# EAGLE design BMS Master V2.0 (EAGLE 6.5.0)
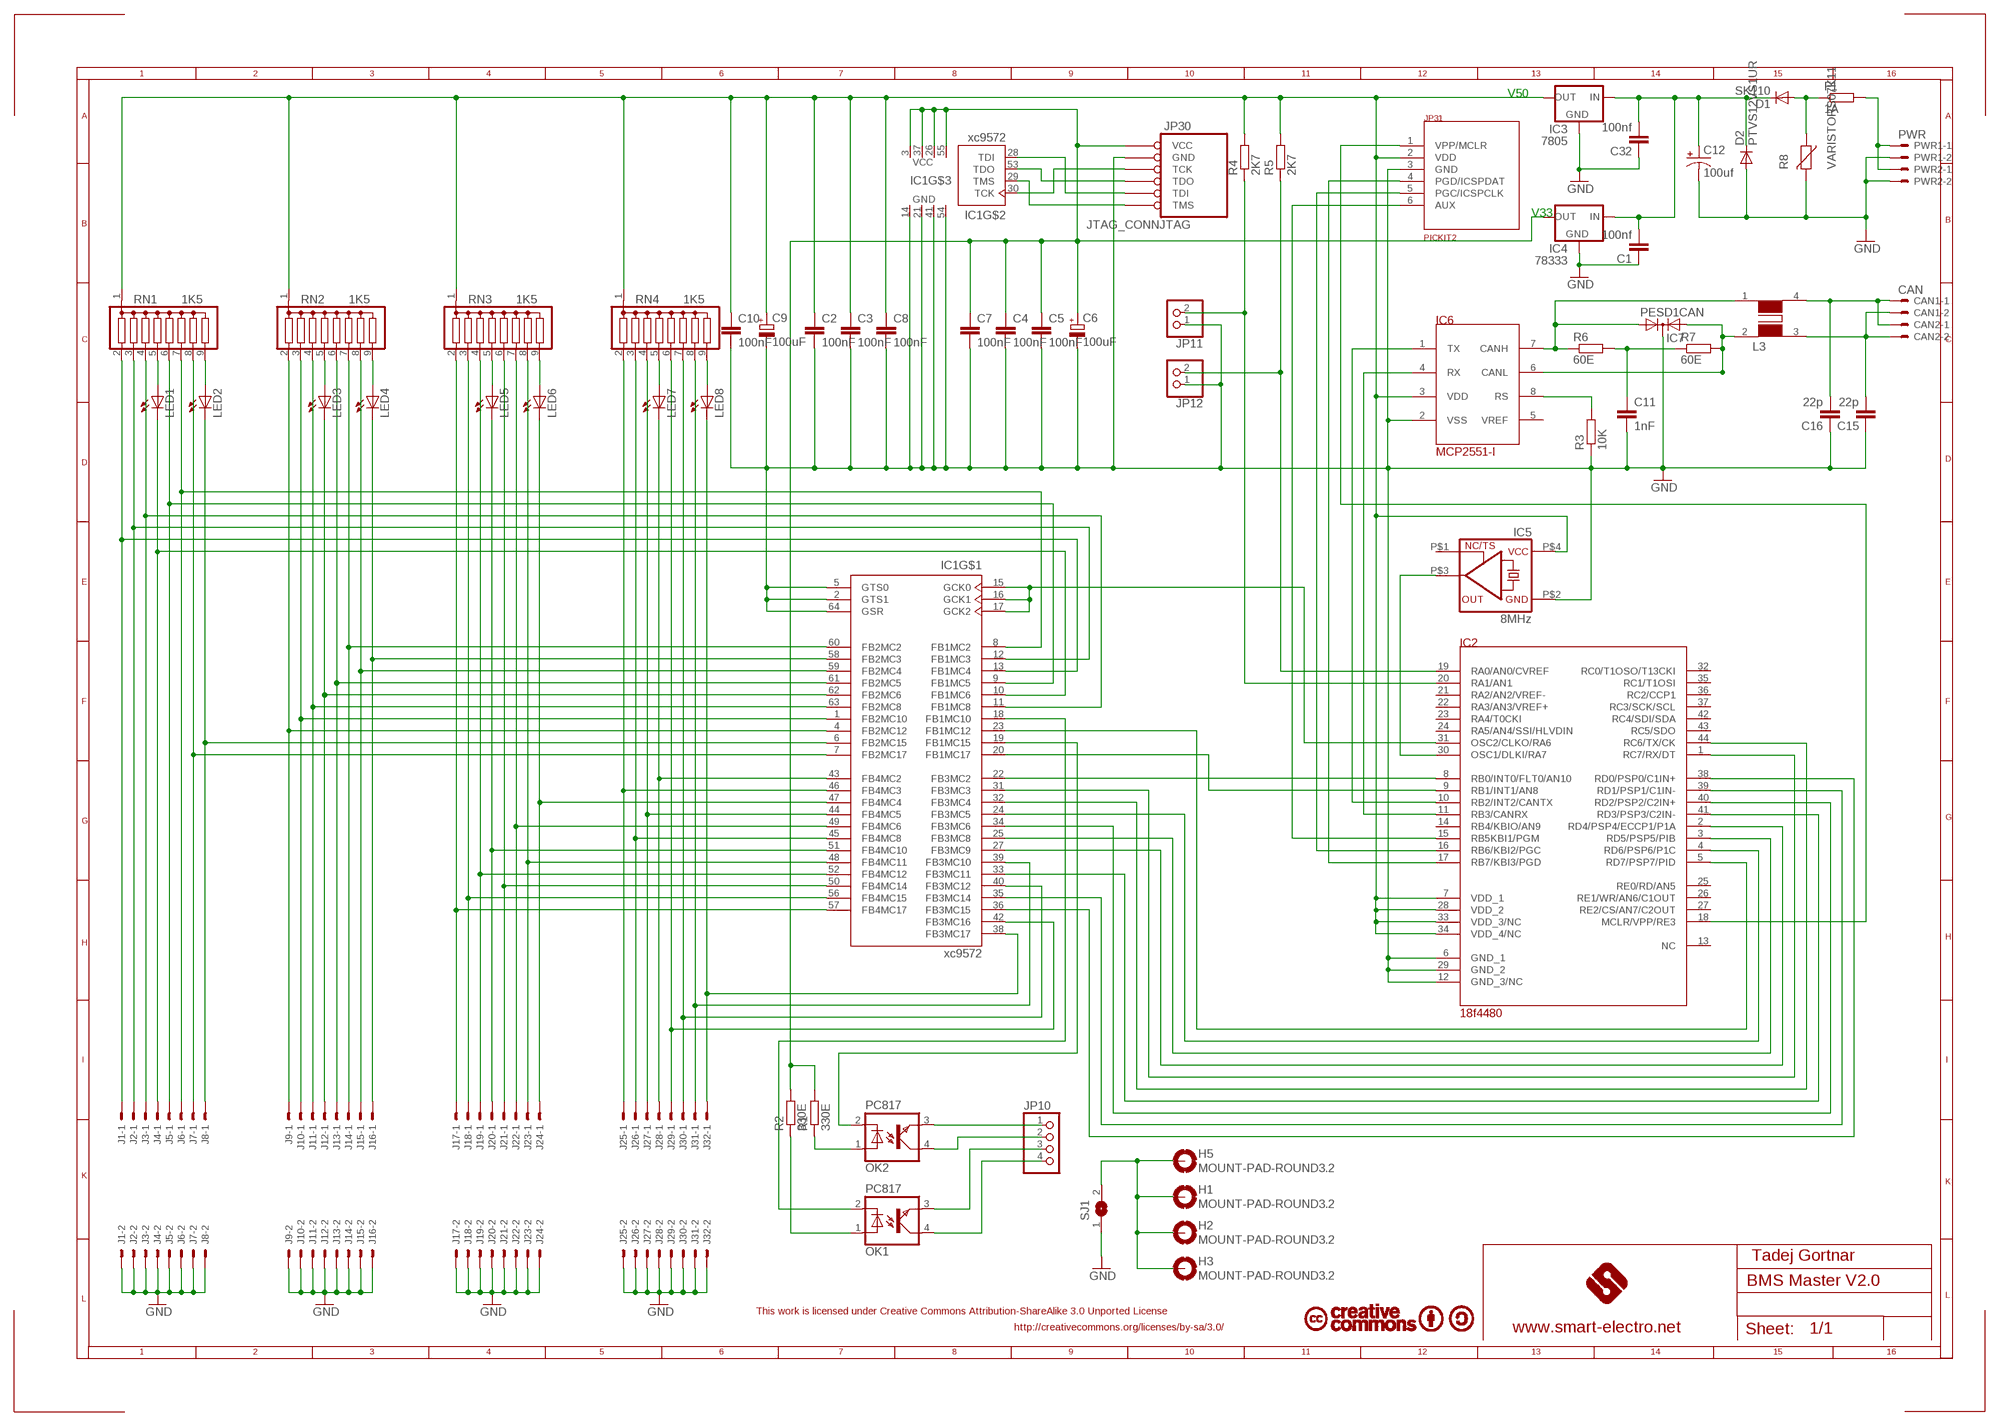
[diagram p0: schematic, sheet 1]

## Parts
C1  100nf  C-EUC0805  [C0805]
C2  100nF  C-EUC0805  [C0805]
C3  100nF  C-EUC0805  [C0805]
C4  100nF  C-EUC0805  [C0805]
C5  100nF  C-EUC0805  [C0805]
C6  100uF  CPOL-EUE2.5-5  [E2,5-5]
C7  100nF  C-EUC0805  [C0805]
C8  100nF  C-EUC0805  [C0805]
C9  100uF  CPOL-EUE2.5-5  [E2,5-5]
C10  100nF  C-EUC0805  [C0805]
C11  1nF  C-EUC0805  [C0805]
C12  100uf  CPOL-USC  [PANASONIC_C]
C15  22p  C-EUC0805  [C0805]
C16  22p  C-EUC0805  [C0805]
C32  100nf  C-EUC0805  [C0805]
CAN1  CAN  22-27-2021-02  [6410-02]
CAN2  CAN  22-27-2021-02  [6410-02]
D1  SK110  DIODE-MINIMELF  [MINIMELF]
D2  PTVS12VS1UR  DIODE-SOD323-W  [SOD323-W]
F1  1A  R-EU_R1206  [R1206]
H1  MOUNT-PAD-ROUND3.2  [3,2-PAD]
H2  MOUNT-PAD-ROUND3.2  [3,2-PAD]
H3  MOUNT-PAD-ROUND3.2  [3,2-PAD]
H5  MOUNT-PAD-ROUND3.2  [3,2-PAD]
IC1  xc9572  XC9572-VQ64  [VQ64]
IC2  18f4480  PIC18F4480  [TQFP44]
IC3  7805  78XXS'SOT223'  [SOT223]
IC4  78333  78XXS'SOT223'  [SOT223]
IC5  8MHz  OSCI7X5  [CSX750]
IC6  MCP2551-I  MCP2551  [SO-08]
IC7  PESD1CAN  BAS70-06  [SOT23]
J1  22-27-2021-02  [6410-02]
J2  22-27-2021-02  [6410-02]
J3  22-27-2021-02  [6410-02]
J4  22-27-2021-02  [6410-02]
J5  22-27-2021-02  [6410-02]
J6  22-27-2021-02  [6410-02]
J7  22-27-2021-02  [6410-02]
J8  22-27-2021-02  [6410-02]
J9  22-27-2021-02  [6410-02]
J10  22-27-2021-02  [6410-02]
J11  22-27-2021-02  [6410-02]
J12  22-27-2021-02  [6410-02]
J13  22-27-2021-02  [6410-02]
J14  22-27-2021-02  [6410-02]
J15  22-27-2021-02  [6410-02]
J16  22-27-2021-02  [6410-02]
J17  22-27-2021-02  [6410-02]
J18  22-27-2021-02  [6410-02]
J19  22-27-2021-02  [6410-02]
J20  22-27-2021-02  [6410-02]
J21  22-27-2021-02  [6410-02]
J22  22-27-2021-02  [6410-02]
J23  22-27-2021-02  [6410-02]
J24  22-27-2021-02  [6410-02]
J25  22-27-2021-02  [6410-02]
J26  22-27-2021-02  [6410-02]
J27  22-27-2021-02  [6410-02]
J28  22-27-2021-02  [6410-02]
J29  22-27-2021-02  [6410-02]
J30  22-27-2021-02  [6410-02]
J31  22-27-2021-02  [6410-02]
J32  22-27-2021-02  [6410-02]
JP10  PINHD-1X4  [1X04]
JP11  PINHD-1X2  [1X02]
JP12  PINHD-1X2  [1X02]
JP30  JTAG_CONNJTAG  [PIN06]
JP31  PICKIT2  [PINHD-1X6]
L3  WE-DD_M/S  [WE-DD_M/S]
LED1  LEDCHIPLED_0805  [CHIPLED_0805]
LED2  LEDCHIPLED_0805  [CHIPLED_0805]
LED3  LEDCHIPLED_0805  [CHIPLED_0805]
LED4  LEDCHIPLED_0805  [CHIPLED_0805]
LED5  LEDCHIPLED_0805  [CHIPLED_0805]
LED6  LEDCHIPLED_0805  [CHIPLED_0805]
LED7  LEDCHIPLED_0805  [CHIPLED_0805]
LED8  LEDCHIPLED_0805  [CHIPLED_0805]
OK1  PC817  [DIL04]
OK2  PC817  [DIL04]
PWR1  PWR  22-27-2021-02  [6410-02]
PWR2  PWR  22-27-2021-02  [6410-02]
R1  330E  R-EU_M0805  [M0805]
R2  330E  R-EU_M0805  [M0805]
R3  10K  R-EU_M0805  [M0805]
R4  2K7  R-EU_M0805  [M0805]
R5  2K7  R-EU_M0805  [M0805]
R6  60E  R-EU_R0805  [R0805]
R7  60E  R-EU_R0805  [R0805]
R8  VARISTORS07K11  [S07K11]
RN1  1K5  G08R  [SIL9]
RN2  1K5  G08R  [SIL9]
RN3  1K5  G08R  [SIL9]
RN4  1K5  G08R  [SIL9]
SJ1  SJ  [SJ]

## Nets
AGND: H1.B3,2(MOUNT) H2.B3,2(MOUNT) H3.B3,2(MOUNT) H5.B3,2(MOUNT) SJ1.2
GND: C1.1 C2.2 C3.2 C4.2 C5.2 C6.- C7.2 C8.2 C9.- C10.2 C11.2 C12.- C15.1 C16.1 C32.1 D2.A IC1.2(GTS1) IC1.5(GTS0) IC1.14(GND) IC1.21(GND) IC1.41(GND) IC1.54(GND) IC1.64(GSR) IC2.6(GND_1) IC2.12(GND_3/NC) IC2.29(GND_2) IC3.2(GND) IC4.2(GND) IC5.P$2(GND) IC6.2(VSS) IC7.3(C) J1.2 J2.2 J3.2 J4.2 J5.2 J6.2 J7.2 J8.2 J9.2 J10.2 J11.2 J12.2 J13.2 J14.2 J15.2 J16.2 J17.2 J18.2 J19.2 J20.2 J21.2 J22.2 J23.2 J24.2 J25.2 J26.2 J27.2 J28.2 J29.2 J30.2 J31.2 J32.2 JP11.1 JP12.1 JP30.2(GND) JP31.3(GND) PWR1.2 PWR2.2 R3.1 R8.2 SJ1.1
N$1: IC1.23(FB1MC12) IC2.5(RD7/PSP7/PID)
N$2: IC1.9(FB1MC5) J5.1 RN1.6
N$3: IC1.8(FB1MC2) J6.1 RN1.7
N$4: IC1.44(FB4MC5) J27.1 RN4.4
N$5: IC1.45(FB4MC8) J26.1 RN4.3
N$6: IC1.46(FB4MC3) J25.1 RN4.2
N$7: IC1.7(FB2MC17) J7.1 RN1.8
N$8: IC1.61(FB2MC5) J13.1 RN2.6
N$9: IC1.60(FB2MC2) J14.1 RN2.7
N$10: IC1.52(FB4MC12) J19.1 RN3.4
N$11: IC1.56(FB4MC15) J18.1 RN3.3
N$12: IC2.18(MCLR/VPP/RE3) JP31.1(VPP/MCLR)
N$13: IC1.59(FB2MC4) J15.1 RN2.8
N$14: IC1.50(FB4MC14) J21.1 RN3.6
N$15: IC1.49(FB4MC6) J22.1 RN3.7
N$16: IC1.63(FB2MC8) J11.1 RN2.4
N$17: IC1.1(FB2MC10) J10.1 RN2.3
N$18: IC1.4(FB2MC12) J9.1 RN2.2
N$19: IC1.48(FB4MC11) J23.1 RN3.8
N$20: IC1.42(FB3MC16) J29.1 RN4.6
N$21: IC1.40(FB3MC12) J30.1 RN4.7
N$22: IC1.11(FB1MC8) J3.1 RN1.4
N$23: IC1.12(FB1MC3) J2.1 RN1.3
N$24: IC1.13(FB1MC4) J1.1 RN1.2
N$25: IC2.17(RB7/KBI3/PGD) JP31.4(PGD/ICSPDAT)
N$26: IC2.16(RB6/KBI2/PGC) JP31.5(PGC/ICSPCLK)
N$31: IC2.10(RB2/INT2/CANTX) IC6.1(TX)
N$32: IC2.11(RB3/CANRX) IC6.4(RX)
N$33: C11.1 R6.2 R7.1
N$34: IC6.7(CANH) IC7.1(A1) L3.1 R6.1
N$35: IC2.30(OSC1/DLKI/RA7) IC5.P$3(OUT)
N$36: C1.2 C12.+ C32.2 D1.C D2.C IC3.1(IN) IC4.1(IN)
N$37: IC1.15(GCK0) IC1.16(GCK1) IC1.17(GCK2) IC2.31(OSC2/CLKO/RA6)
N$38: IC1.57(FB4MC17) J17.1 RN3.2
N$39: IC1.38(FB3MC17) J32.1 LED8.C
N$40: IC1.36(FB3MC15) IC2.38(RD0/PSP0/C1IN+)
N$41: IC1.35(FB3MC14) IC2.39(RD1/PSP1/C1IN-)
N$42: IC1.34(FB3MC6) IC2.40(RD2/PSP2/C2IN+)
N$43: IC1.33(FB3MC11) IC2.41(RD3/PSP3/C2IN-)
N$44: IC1.32(FB3MC4) IC2.44(RC6/TX/CK)
N$45: IC1.31(FB3MC3) IC2.1(RC7/RX/DT)
N$46: IC1.27(FB3MC9) IC2.2(RD4/PSP4/ECCP1/P1A)
N$47: IC1.19(FB1MC15) OK2.2(C)
N$48: IC1.18(FB1MC10) OK1.2(C)
N$49: OK1.1(A) R2.1
N$50: OK2.1(A) R1.1
N$51: JP10.4 OK1.4(COL)
N$52: JP10.3 OK1.3(EMIT)
N$53: JP10.2 OK2.4(COL)
N$54: JP10.1 OK2.3(EMIT)
N$55: LED1.A RN1.5
N$56: IC1.39(FB3MC10) J31.1 RN4.8
N$57: LED3.A RN2.5
N$58: LED2.A RN1.9
N$59: LED5.A RN3.5
N$60: LED4.A RN2.9
N$61: LED7.A RN4.5
N$62: LED6.A RN3.9
N$63: IC1.10(FB1MC6) J4.1 LED1.C
N$64: LED8.A RN4.9
N$65: IC1.58(FB2MC3) J16.1 LED4.C
N$66: IC1.51(FB4MC10) J20.1 LED5.C
N$67: IC1.6(FB2MC15) J8.1 LED2.C
N$68: IC1.62(FB2MC6) J12.1 LED3.C
N$69: IC1.47(FB4MC4) J24.1 LED6.C
N$70: IC1.43(FB4MC2) J28.1 LED7.C
N$71: IC1.25(FB3MC8) IC2.3(RD5/PSP5/PIB)
N$72: IC1.24(FB3MC5) IC2.4(RD6/PSP6/P1C)
N$73: IC6.8(RS) R3.2
N$74: IC2.19(RA0/AN0/CVREF) JP12.2 R5.1
N$75: IC2.20(RA1/AN1) JP11.2 R4.1
N$78: IC2.15(RB5KBI1/PGM) JP31.6(AUX)
N$79: IC1.20(FB1MC17) IC2.9(RB1/INT1/AN8)
N$80: IC1.22(FB3MC2) IC2.8(RB0/INT0/FLT0/AN10)
N$82: IC6.6(CANL) IC7.2(A2) L3.2 R7.2
N$83: F1.2 PWR1.1 PWR2.1
N$84: D1.A F1.1 R8.1
N$88: C16.2 CAN1.1 CAN2.1 L3.4
N$89: C15.2 CAN1.2 CAN2.2 L3.3
TCK: IC1.30(TCK) JP30.3(TCK)
TDI: IC1.28(TDI) JP30.5(TDI)
TDO: IC1.53(TDO) JP30.4(TDO)
TMS: IC1.29(TMS) JP30.6(TMS)
V33: C4.1 C5.1 C6.+ C7.1 IC1.3(VCC) IC1.26(VCC) IC1.37(VCC) IC1.55(VCC) IC4.3(OUT) JP30.1(VCC) R1.2 R2.2
V50: C2.1 C3.1 C8.1 C9.+ C10.1 IC2.7(VDD_1) IC2.28(VDD_2) IC2.33(VDD_3/NC) IC2.34(VDD_4/NC) IC3.3(OUT) IC5.P$4(VCC) IC6.3(VDD) JP31.2(VDD) R4.2 R5.2 RN1.1 RN2.1 RN3.1 RN4.1
Unconnected: IC2.13(NC) IC2.14(RB4/KBIO/AN9) IC2.21(RA2/AN2/VREF-) IC2.22(RA3/AN3/VREF+) IC2.23(RA4/T0CKI) IC2.24(RA5/AN4/SSI/HLVDIN) IC2.25(RE0/RD/AN5) IC2.26(RE1/WR/AN6/C1OUT) IC2.27(RE2/CS/AN7/C2OUT) IC2.32(RC0/T1OSO/T13CKI) IC2.35(RC1/T1OSI) IC2.36(RC2/CCP1) IC2.37(RC3/SCK/SCL) IC2.42(RC4/SDI/SDA) IC2.43(RC5/SDO) IC5.P$1(TS) IC6.5(VREF)

## Notes on the sheet
- Tadej Gortnar
- This work is licensed under Creative Commons Attribution-ShareAlike 3.0 Unported License
- http://creativecommons.org/licenses/by-sa/3.0/ | www.smart-electro.net

## Library data of the parts
C1 C32 = resistor:C-EU: CAPACITOR, European symbol
C2-C5 C7 C8 C10 C11 C15 C16 = rcl:C-EU: CAPACITOR, European symbol
C6 C9 = rcl:CPOL-EU: POLARIZED CAPACITOR, European symbol
C12 = resistor:CPOL-US: POLARIZED CAPACITOR, American symbol
CAN1 CAN2 J1-J32 PWR1 PWR2 = con-molex:22-?-02: CONNECTOR wire to board 2.54 mm (.1 inch) pitch header; OC_FARNELL: unknown; OC_NEWARK: unknown
D1 D2 = diode:DIODE-: DIODE
F1 = resistor:R-EU_: RESISTOR, European symbol
H1-H3 H5 = holes:MOUNT-PAD-ROUND: MOUNTING PAD, round
IC1 = XILINX:XC9572-VQ64
IC2 = microchip-5:PIC18F4*80: PIC18F4*80 - CAN, I²C, SPI, UART/USART, Brown-out Detect/Reset, HLVD, POR, PWM, WDT
IC3 IC4 = v-reg:78XXS: VOLTAGE REGULATOR
IC5 = crystal:OSCI7X5: OSCILATOR 7mm X 5mm
IC6 = microchip-5:MCP2551: High Speed CAN Transceiver
IC7 = diode:BAS70-06: Silicon Schottky Diodes General-purpose diode for high-speed switching
JP10 = pinhead:PINHD-1X4: PIN HEADER
JP11 JP12 = pinhead_old:PINHD-1X2
JP30 = tadej:JTAG_CONN: JTAG Konektor
JP31 = microchip-5:PICKIT2: PIC Kit 2 - Programer
L3 = wuerth-elektronik:WE-DD: SMD-Shielded Power Transformers (SEPIC) WE_DD WE-DD with two identical windings is perfect for SEPIC- switching regulators - 1:1 transformer - Double inductor with two identical windings -- SEPIC-switching regulators
LED1-LED8 = led:LED: LED OSRAM: - CHIPLED LG R971, LG N971, LY N971, LG Q971, LY Q971, LO R971, LY R971 LH N974, LH R974 LS Q976, LO Q976, LY Q976 LO Q996 - Hyper CHIPLED LW Q18S LB Q993, LB Q99A, LB R99A - SideLED LS A670, LO A670, LY A670, LG A670, LP A670 LB A673, LV A673, LT A673, LW A673 LH A674 LY A675 LS A676, LA A676, LO A676, LY A676, LW A676 LS A679, LY A679, LG A679 - Hyper Micro SIDELED® LS Y876, LA Y876, LO Y876, LY Y876 LT Y87S - SmartLED LW L88C, LW L88S LB L89C, LB L89S, LG L890 LS L89K, LO L89K, LY L89K LS L896, LA L896, LO L896, LY L896 - TOPLED LS T670, LO T670, LY T670, LG T670, LP T670 LSG T670, LSP T670, LSY T670, LOP T670, LYG T670 LG T671, LOG T671, LSG T671 LB T673, LV T673, LT T673, LW T673 LH T674 LS T676, LA T676, LO T676, LY T676, LB T676, LH T676, LSB T676, LW T676 LB T67C, LV T67C, LT T67C, LS T67K, LO T67K, LY T67K, LW E67C LS E67B, LA E67B, LO E67B, LY E67B, LB E67C, LV E67C, LT E67C LW T67C LS T679, LY T679, LG T679 LS T770, LO T770, LY T770, LG T770, LP T770 LB T773, LV T773, LT T773, LW T773 LH T774 LS E675, LA E675, LY E675, LS T675 LS T776, LA T776, LO T776, LY T776, LB T776 LHGB T686 LT T68C, LB T68C - Hyper Mini TOPLED® LB M676 - Mini TOPLED Santana® LG M470 LS M47K, LO M47K, LY M47K Source: http://www.osram.convergy.de/
OK1 OK2 = optocoupler:PC817: SHARP OPTO COUPLER
R1-R7 = rcl:R-EU_: RESISTOR, European symbol
R8 = varistor:VARISTOR: VARISTOR
RN1-RN4 = resistor-sil:G08R: SIL RESISTOR
SJ1 = jumper:SJ: SMD solder JUMPER

## Board
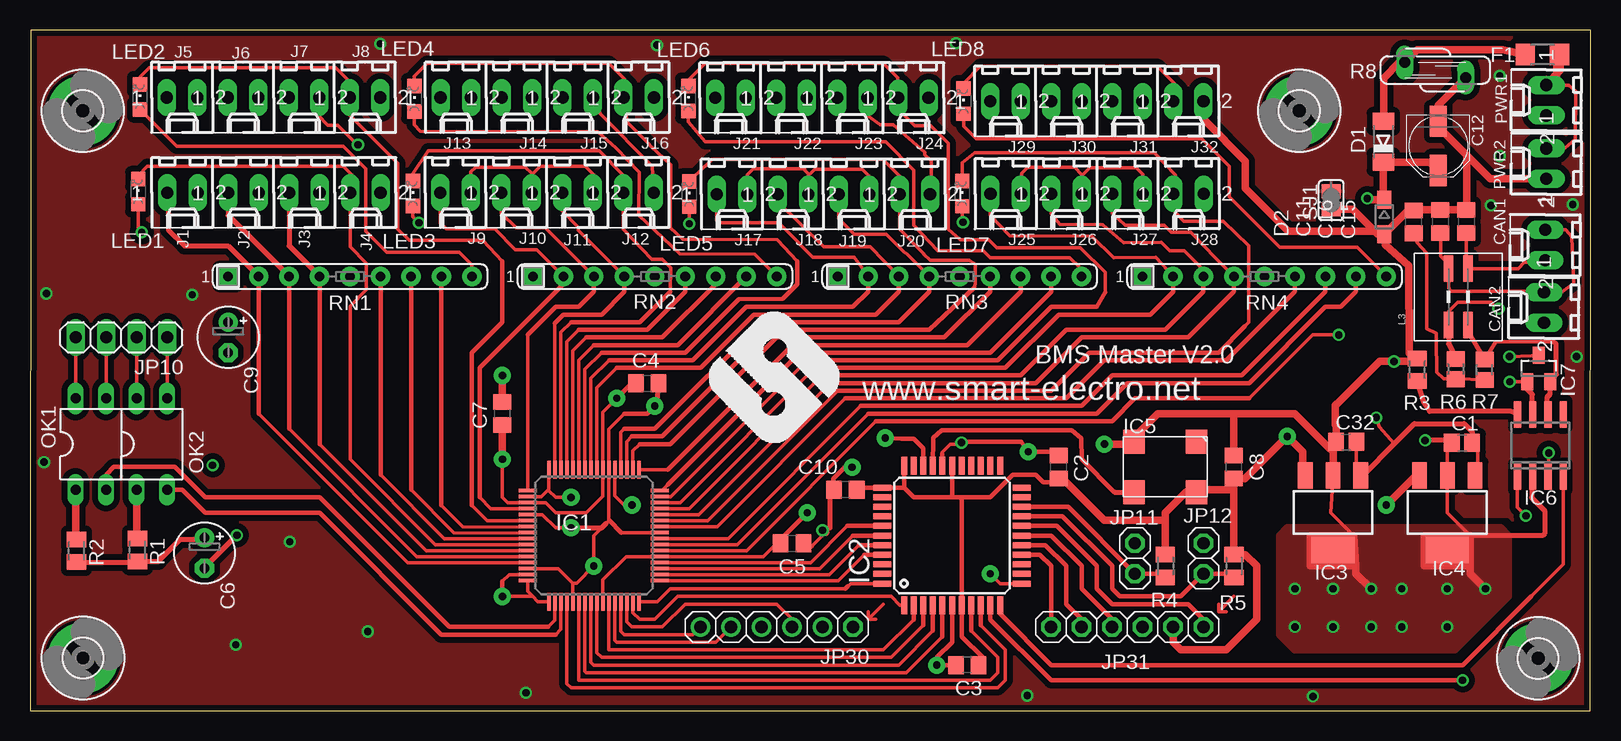
[diagram p1: board, top side]
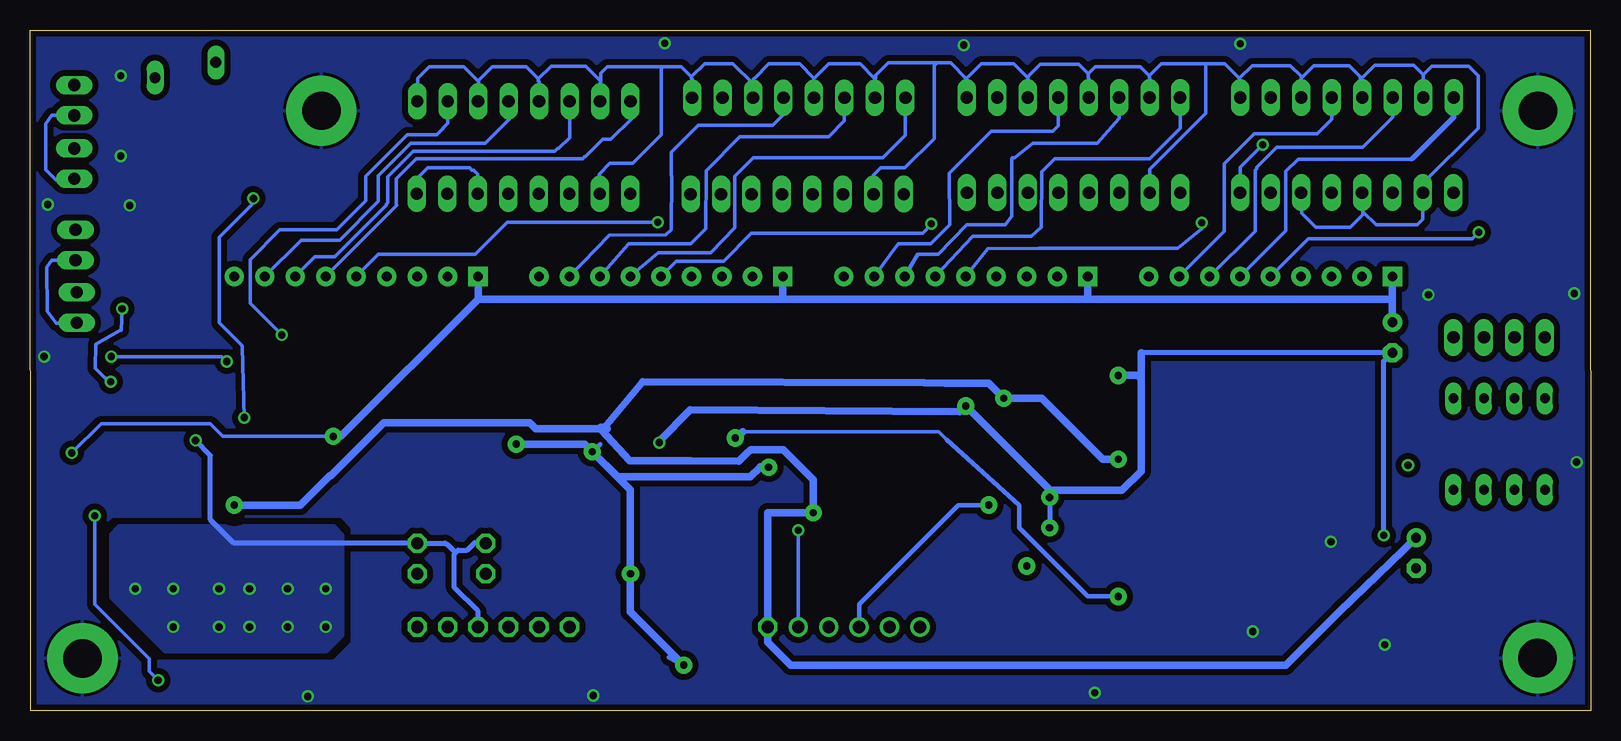
[diagram p2: board, bottom side, seen from below]

Size 130.05 x 56.73 mm. Coordinates in mm from the lower left corner, seen from the top.
Outline: 0,0 130,0 130.05,56.73 0.05,56.73 0,0
Copper layers (1*16): Top 0.035mm / dielectric 1.5mm / Bottom 0.035mm
Design rules "default2 *": minimum track width 10mil, minimum drill 0.6mm, track to track 0.19mm, track to pad 0.19mm, pad to pad 0.19mm, via to via 0.19mm, smd to smd 0.19mm, copper to edge 1mil, drill to drill 8mil, minimum pad ring 10mil, minimum via ring 8mil, stop-mask expansion 4mil, vias tented up to drill 0mil, thermal gap 10mil

### Footprints (pad centres in the part's own frame; a part is rotated, then mirrored left to right if it is on the bottom)
C0805 = smd 1.3 x 1.5: 1 -0.85,0; 2 0.85,0
C0805' = smd 1.3 x 1.5: 1 -0.95,0; 2 0.95,0
E2,5-5 = drill 0.813 pad 1.6: + -1.27,0 | drill 0.813 pad 1.6 octagon: - 1.27,0
PANASONIC_C = smd 2.6 x 1.4: + 2.05,0; - -2.05,0
6410-02 = drill 1.016 long: 1 1.27,0; 2 -1.27,0
MINIMELF = smd 1.4 x 1.8: A 1.7,0; C -1.7,0
SOD323-W = smd 1.5 x 1.2: A 1.45,0; C -1.45,0
R1206 = smd 1.6 x 1.803: 1 -1.422,0; 2 1.422,0
3,2-PAD = drill 3.2 pad 5.842: B3,2 0,0
VQ64 = smd 1.5 x 0.3: 1 -5.5,3.75; 2 -5.5,3.25; 3 -5.5,2.75; 4 -5.5,2.25; 5 -5.5,1.75; 6 -5.5,1.25; 7 -5.5,0.75; 8 -5.5,0.25; 9 -5.5,-0.25; 10 -5.5,-0.75; 11 -5.5,-1.25; 12 -5.5,-1.75; 13 -5.5,-2.25; 14 -5.5,-2.75; 15 -5.5,-3.25; 16 -5.5,-3.75; 33 5.5,-3.75; 34 5.5,-3.25; 35 5.5,-2.75; 36 5.5,-2.25; 37 5.5,-1.75; 38 5.5,-1.25; 39 5.5,-0.75; 40 5.5,-0.25; 41 5.5,0.25; 42 5.5,0.75; 43 5.5,1.25; 44 5.5,1.75; 45 5.5,2.25; 46 5.5,2.75; 47 5.5,3.25; 48 5.5,3.75 | smd 0.3 x 1.5: 17 -3.75,-5.5; 18 -3.25,-5.5; 19 -2.75,-5.5; 20 -2.25,-5.5; 21 -1.75,-5.5; 22 -1.25,-5.5; 23 -0.75,-5.5; 24 -0.25,-5.5; 25 0.25,-5.5; 26 0.75,-5.5; 27 1.25,-5.5; 28 1.75,-5.5; 29 2.25,-5.5; 30 2.75,-5.5; 31 3.25,-5.5; 32 3.75,-5.5; 49 3.75,5.5; 50 3.25,5.5; 51 2.75,5.5; 52 2.25,5.5; 53 1.75,5.5; 54 1.25,5.5; 55 0.75,5.5; 56 0.25,5.5; 57 -0.25,5.5; 58 -0.75,5.5; 59 -1.25,5.5; 60 -1.75,5.5; 61 -2.25,5.5; 62 -2.75,5.5; 63 -3.25,5.5; 64 -3.75,5.5
TQFP44 = smd 1.5 x 0.5: 1 -5.8,4; 2 -5.8,3.2; 3 -5.8,2.4; 4 -5.8,1.6; 5 -5.8,0.8; 6 -5.8,0; 7 -5.8,-0.8; 8 -5.8,-1.6; 9 -5.8,-2.4; 10 -5.8,-3.2; 11 -5.8,-4; 23 5.8,-4; 24 5.8,-3.2; 25 5.8,-2.4; 26 5.8,-1.6; 27 5.8,-0.8; 28 5.8,0; 29 5.8,0.8; 30 5.8,1.6; 31 5.8,2.4; 32 5.8,3.2; 33 5.8,4 | smd 0.5 x 1.5: 12 -4,-5.8; 13 -3.2,-5.8; 14 -2.4,-5.8; 15 -1.6,-5.8; 16 -0.8,-5.8; 17 0,-5.8; 18 0.8,-5.8; 19 1.6,-5.8; 20 2.4,-5.8; 21 3.2,-5.8; 22 4,-5.8; 34 4,5.8; 35 3.2,5.8; 36 2.4,5.8; 37 1.6,5.8; 38 0.8,5.8; 39 0,5.8; 40 -0.8,5.8; 41 -1.6,5.8; 42 -2.4,5.8; 43 -3.2,5.8; 44 -4,5.8
SOT223 = smd 1.219 x 2.235: 1 -2.311,-3.099; 2 0,-3.099; 3 2.311,-3.099 | smd 3.6 x 2.2: 4 0,3.099
CSX750 = smd 1.8 x 2: P$1 -2.6,-2.1; P$2 2.6,-2.1; P$3 2.6,2.1; P$4 -2.6,2.1
SO-08 = smd 0.6 x 2.2: 1 -1.905,-2.6; 2 -0.635,-2.6; 3 0.635,-2.6; 4 1.905,-2.6; 5 1.905,2.6; 6 0.635,2.6; 7 -0.635,2.6; 8 -1.905,2.6
SOT23 = smd 1 x 1.4: 1 -0.95,-1.1; 2 0.95,-1.1; 3 0,1.1
1X04 = drill 1.016 long: 1 -3.81,0; 2 -1.27,0; 3 1.27,0; 4 3.81,0
1X02 = drill 1.016 pad 1.6 octagon: 1 -1.27,0; 2 1.27,0
PIN06 = drill 1.016 pad 1.6 octagon: 1 -5.08,0 | drill 1.016 pad 1.6: 2 -2.54,0; 3 0,0; 4 2.54,0; 5 5.08,0; 6 7.62,0
PINHD-1X6 = drill 1.016 pad 1.6 octagon: 1 -6.35,0; 2 -3.81,0; 3 -1.27,0; 4 1.27,0; 5 3.81,0; 6 6.35,0
WE-DD_M/S = smd 0.8 x 2.2: 1 -0.8,-2.35; 2 0.8,-2.35; 3 0.8,2.35; 4 -0.8,2.35
CHIPLED_0805 = smd 1.2 x 1.2: A 0,-1.05; C 0,1.05
DIL04 = drill 0.813 long: 1 -1.27,-3.81; 2 1.27,-3.81; 3 1.27,3.81; 4 -1.27,3.81
M0805 = smd 1.3 x 1.6: 1 -0.95,0; 2 0.95,0
R0805 = smd 1.3 x 1.5: 1 -0.85,0; 2 0.85,0
S07K11 = drill 0.914 long: 1 -0.635,-2.54; 2 0.635,2.54
SIL9 = drill 0.813 pad 1.6 square: 1 -10.16,0 | drill 0.813 pad 1.6: 2 -7.62,0; 3 -5.08,0; 4 -2.54,0; 5 0,0; 6 2.54,0; 7 5.08,0; 8 7.62,0; 9 10.16,0
SJ = smd 1.168 x 1.6: 1 -0.762,0; 2 0.762,0

### Placement (x,y rotation side)
C1  119.33,22.33 0 top
C2  100nF  [C0805']  85.72,20.32 90 top
C3  100nF  [C0805']  78.11,3.81 180 top
C4  100nF  [C0805']  51.44,27.3 0 top
C5  100nF  [C0805']  63.5,13.97 0 top
C6  14.54,13.14 270 top
C7  100nF  [C0805']  39.37,24.77 90 top
C8  100nF  [C0805']  100.33,20.32 90 top
C9  16.51,31.11 270 top
C10  100nF  [C0805']  67.94,18.41 180 top
C11  1nF  [C0805']  115.32,40.74 90 top
C12  117.35,47.07 270 top
C15  22p  [C0805']  119.68,40.77 270 top
C16  22p  [C0805']  117.53,40.77 270 top
C32  109.68,22.4 0 top
CAN1  126.26,38.81 90 top
CAN2  126.16,33.6 90 top
D1  112.78,47.42 90 top
D2  112.85,41.15 270 top
F1  126.03,54.69 0 top
H1  4.42,4.39 0 top
H2  125.68,4.37 0 top
H3  105.77,50 0 top
H5  4.39,50 0 top
IC1  46.99,14.61 0 top
IC2  76.83,14.61 90 top
IC3  108.58,16.51 180 top
IC4  118.11,16.51 180 top
IC5  94.61,20.32 180 top
IC6  125.86,22.1 0 top
IC7  125.73,28.52 0 top
J1  12.7,43.18 180 top
J2  17.78,43.18 180 top
J3  22.86,43.18 180 top
J4  27.94,43.18 180 top
J5  12.67,51.1 180 top
J6  17.75,51.1 180 top
J7  22.83,51.1 180 top
J8  27.91,51.1 180 top
J9  35.46,43.18 180 top
J10  40.54,43.18 180 top
J11  45.62,43.18 180 top
J12  50.7,43.18 180 top
J13  35.48,51.1 180 top
J14  40.56,51.1 180 top
J15  45.64,51.1 180 top
J16  50.72,51.1 180 top
J17  58.5,43.05 180 top
J18  63.58,43.05 180 top
J19  68.66,43.05 180 top
J20  73.74,43.05 180 top
J21  58.37,51.08 180 top
J22  63.45,51.08 180 top
J23  68.53,51.08 180 top
J24  73.61,51.08 180 top
J25  81.31,43.08 180 top
J26  86.39,43.08 180 top
J27  91.47,43.08 180 top
J28  96.55,43.08 180 top
J29  81.28,50.8 180 top
J30  86.36,50.8 180 top
J31  91.44,50.8 180 top
J32  96.52,50.8 180 top
JP10  7.62,31.11 180 top
JP11  92.08,12.7 270 top
JP12  97.79,12.7 270 top
JP30  63.5,6.99 180 top
JP31  91.44,6.99 180 top
L3  119.02,34.49 0 top
LED1  9.02,43.26 0 top
LED2  9.17,51.16 0 top
LED3  31.9,43.1 0 top
LED4  32.03,51 0 top
LED5  54.94,43.05 0 top
LED6  54.86,51.03 0 top
LED7  77.69,43.09 0 top
LED8  77.8,50.8 0 top
OK1  5.08,22.23 0 top
OK2  10.16,22.23 0 top
PWR1  126.36,50.88 90 top
PWR2  126.36,45.59 90 top
R1  8.95,13.4 270 top
R2  3.87,13.34 270 top
R3  115.6,28.42 270 top
R4  94.61,12.06 90 top
R5  100.33,12.06 90 top
R6  118.82,28.47 270 top
R7  121.21,28.42 90 top
R8  117.09,53.39 270 top
RN1  26.67,36.2 0 top
RN2  52.07,36.2 0 top
RN3  77.47,36.2 0 top
RN4  102.87,36.2 0 top
SJ1  108.43,42.55 90 top

### Tracks (layer width: path | path; a pad name or v marks a point on that pad's centre or on a via)
AGND  (via drill 0.6)
  other vias: 13.51,34.67 21.64,14.1 28.14,6.6 41.33,1.5 83.11,1.27 106.91,1.19 77.17,55.63 52.25,55.47 29.18,55.58 17.14,5.51 128.88,29.51 1.37,34.77 1.17,20.73 122.48,52.91 122.48,46.23 121.74,42.11 128.57,42.19
  pour Bottom (isolate 0.5, rank 2): 0.08,56.74 129.9,56.74 129.9,-0.18 0.1,-0.18 0.1,56.72
  pour Top (isolate 0.5, rank 2): -0.15,56.85 130.1,57 130.1,0.08 -0.13,-0.08 -0.13,56.82
GND  (via drill 0.6, 0.6 pad 1.42)
  Top 0.305: IC1.2 42.62,17.86 43.24,18.48 | 43.24,18.48 IC1.64 | IC1.5 42.7,16.36 43.81,15.24 v45.09,15.24 | 43.24,18.48 43.24,18.36 43.81,17.78 v45.09,17.78 | 49.53,24.77 48.24,23.48 IC1.54 48.24,15.88 48.26,15.88 48.01,15.62 46.99,14.61 v46.99,12.06 45.56,10.64 45.24,10.64 | 49.28,14.86 IC1.41 | 45.24,10.64 IC1.21 | IC1.14 44.02,11.86 45.24,10.64 | IC2.12 80.83,10.61 v80.01,11.43 | C1.1 118.11,21.96 IC4.2 118.11,16.51 120.02,14.61 | 110.31,14.61 108.41,16.51 IC3.2 | v27.33,47.17 27.25,47.17 25.63,48.79 24.82,48.79 24,49.61 24,51 J7.2 | J12.2 51.87,45.36 47.52,49.76 46.99,51.03 J15.2 | J11.2 47.02,43.31 47.02,44.63 46.28,45.36 42.52,45.36 41.81,44.65 J10.2 41.81,44.78 41.27,45.31 37.13,45.31 36.73,44.91 J9.2 | J23.2 69.83,49.58 70.87,48.82 71.96,48.82 74.57,46.56 74.57,46.35 75.11,45.82 75.11,43.16 J20.2 | J27.2 92.73,44.73 92.2,45.26 88.32,45.26 87.73,44.68 | 87.73,44.68 87.66,44.68 87.05,45.29 83.13,45.29 82.63,44.78 82.63,43.13 J25.2 | J26.2 87.66,44.6 87.73,44.68 | J17.2 59.77,44.68 60.27,45.19 64.49,45.19 64.57,45.11 64.57,45.03 64.92,44.68 | 64.92,44.68 65.38,45.14 69.34,45.14 69.93,44.55 J19.2 | J18.2 64.85,44.6 64.92,44.68 | D2.A 112.32,39.7 112.17,39.7 | C11.2 115.62,41.72 C16.1 C15.1 | IC7.3 125.14,29.57 v123.29,29.52 | 97.92,50.8 J32.2 97.84,50.75 97.84,49.15 | 65.14,13.7 66.31,14.87 66.67,15.24 | 76.03,21.43 76.03,21.53 76.71,22.2 77.47,22.2 v77.62,22.35
  Top 0.356: IC2.29 76.03,21.43 | 48.26,15.88 49.28,14.86 | 39.37,27.86 v39.37,27.94 | 49.53,24.77 51.44,24.77 v52.07,25.4 | C5.2 64.5,13.7 65.14,13.7 | C2.2 85.72,21.59 v83.19,21.59 82.6,22.4 77.62,22.4 | IC2.6 76.83,5.71 75.56,4.45 v75.56,3.81 C3.2 77.47,3.81 | C8.2 100.33,21.59 | C10.2 66.94,19.32 67.94,20.32 v68.5,20.3
  Top 0.406: C4.2 52.28,25.61 v52.07,25.4 | C1.1 118.25,22.55 v116.26,22.53 | 115.47,29.11 115.78,29.42 R3.1 | IC6.2 125.15,19.42 125.15,17.75 126.21,16.69 126.21,14.76 126.06,14.61 119.48,14.61 | C6.- 14.54,11.93 v17.25,14.63 | v45.09,15.24 47.62,15.24 48.01,15.62 | 66.67,15.24 66.67,18.09 C10.2 | C32.1 108.83,21.83 108.58,21.59
  Top 0.61: 110.49,12.06 106.68,12.06 106.68,14.61 110.31,14.61 110.49,12.06 | 120.02,12.06 116.2,12.06 116.2,14.61 119.48,14.61 120.02,14.61 120.02,12.06 | 110.49,12.06 110.49,11.43 v111.76,10.16 | 120.02,12.06 120.02,11.43 v121.28,10.16 | 100.33,24.77 105.41,24.77 108.2,21.97 | 100.33,24.77 C8.2 | 108.2,21.97 108.58,21.59 IC3.2 | 100.33,24.77 93.98,24.77 92.02,22.8 IC5.P$2 92.02,22.29 92.08,22.23 v89.53,22.23 | R8.2 117.35,50.47 C12.- 117.35,48.67 119.71,46.3 | 119.71,41.81 119.71,41.74 C15.1 | 119.71,46.3 119.71,41.81 | 119.71,41.81 119.63,41.73 114.89,41.73 D2.A | PWR2.2 121.69,44.32 119.71,46.3 | D2.A 112.96,38.83 114.88,37.08 114.94,29.79 115.47,29.11 v113.67,29.11 112.47,29.11 108.94,25.58 108.92,25.58 108.79,25.45 108.79,23.82 108.84,23.77 108.84,22.61 108.2,21.97 | 97.84,49.15 97.92,49.15 101.27,45.8 101.27,43.56 104.85,39.98 112.57,39.98 D2.A | C7.2 39.37,27.86 | v66.04,15.04 66.14,15.04 66.31,14.87 | 77.6,22.28 77.62,22.4 v77.62,22.35 | SJ1.1 110.23,41.78 112.32,39.7
  Bottom 0.305: J5.2 13.95,53.01 | 13.95,53.01 14.73,53.8 18.01,53.8 19.07,52.73 19.07,52.6 | J6.2 19.07,51.16 19.07,52.6 | 19.07,52.6 19.18,52.7 19.18,52.83 20.12,53.77 23.06,53.77 24.13,52.7 | 24.13,52.7 24.13,52.86 25.04,53.77 28.19,53.77 29.26,52.7 | 29.26,52.7 29.26,51.18 J8.2 | J7.2 24.11,52.68 24.13,52.7 | J13.2 36.75,52.76 36.78,52.78 36.78,52.91 | 36.78,52.91 35.76,53.92 31.95,53.92 | 31.95,53.92 30.48,53.92 29.26,52.7 | J14.2 41.83,52.73 41.86,52.76 41.86,53.09 | 41.86,53.09 41.27,53.67 37.54,53.67 36.78,52.91 | J15.2 46.91,52.76 | 46.91,52.76 46.86,52.81 46.86,52.88 45.87,53.87 42.65,53.87 41.86,53.09 | J16.2 51.99,52.6 52.02,52.63 52.02,52.68 | 52.02,52.68 50.77,53.92 48.08,53.92 46.91,52.76 | J21.2 59.64,52.65 | 59.64,52.65 59.59,52.7 59.59,52.96 58.55,54 54.46,54 | 54.46,54 53.34,54 52.02,52.68 | J22.2 64.72,52.7 | 64.72,52.7 64.67,52.76 64.64,52.76 63.5,53.9 60.88,53.9 59.64,52.65 | J23.2 69.8,52.25 | 69.8,52.25 69.8,52.63 69.7,52.73 69.67,52.73 68.5,53.9 65.91,53.9 64.72,52.7 | J24.2 74.88,52.65 74.93,52.7 74.93,52.83 | 74.93,52.83 73.84,53.92 71.48,53.92 69.8,52.25 | J29.2 82.55,52.32 82.5,52.38 82.5,52.48 | 82.5,52.48 82.5,53.11 81.94,53.67 77.29,53.67 | 77.29,53.67 75.77,53.67 74.93,52.83 | J30.2 87.63,52.4 87.68,52.45 87.68,52.65 | 87.68,52.65 86.61,53.72 83.74,53.72 82.5,52.48 | J31.2 92.71,52.22 92.66,52.27 92.66,52.43 | 92.66,52.43 92.66,52.53 91.52,53.67 88.7,53.67 87.68,52.65 | J32.2 97.79,52.22 97.74,52.27 97.74,52.7 96.77,53.67 93.9,53.67 92.66,52.43 | 18.97,41.58 17.88,40.49 14.43,40.49 13.97,40.95 J1.2 13.97,43.94 9.37,48.54 9.37,52.91 10.16,53.7 13.26,53.7 13.95,53.01
  Bottom 0.305: 18.97,41.58 18.97,41.35 20.04,40.28 22.91,40.28 24.08,41.45 24.08,43.13 J3.2 | 18.97,41.58 18.97,43.1 J2.2 | J4.2 29.21,45.29 v27.33,47.17 | J9.2 36.73,45.14 32.08,49.78 32.08,53.8 31.95,53.92 | J17.2 59.77,44.63 59.16,45.24 57.15,45.24 54.71,47.68 54.71,53.75 54.46,54 | 77.29,53.67 77.44,53.52 77.44,48.01 79.83,45.62 81.74,45.62 82.63,44.73 82.63,43.13 J25.2 | PWR1.2 128.25,49.61 128.73,48.92 128.73,45.09 127.91,44.25 126.44,44.25 PWR2.2 | J28.2 97.81,44.32 96.9,45.24 93.4,45.24 93.22,45.06 93.07,45.06 92.73,44.73 J27.2 | JP30.2 v66.04,15.04 | v123.29,29.52 114.07,29.52 v113.67,29.11
  Bottom 0.356: v83.19,21.59 82.55,22.23 | v75.56,3.81 76.83,4.45 | v80.01,11.43 80.01,12.06 | v68.5,20.3 69.22,20.32
  Bottom 0.406: v17.25,14.63 17.25,29.11 C9.- 37.47,29.84 | v45.09,17.78 v45.09,15.24 | JP31.3 92.71,8.28 94.69,10.26 94.69,13.08 94.59,13.18 | 94.59,13.18 94.39,13.39 93.62,13.39 92.99,14.02 92.13,14.02 JP11.1 | 94.59,13.18 95.3,13.89 95.38,13.89 95.45,13.97 JP12.1 113.06,13.97 115.01,15.93 115.01,21.29 v116.26,22.53
  Bottom 0.61: v89.53,22.23 83.82,22.23 v83.19,21.59 | 80.01,12.06 80.01,18.41 v83.19,21.59 | 69.22,20.32 69.22,20.3 70.03,19.48 81.08,19.48 v83.19,21.59 | v80.01,11.43 80.01,8.26 v75.56,3.81 | 37.47,29.84 37.47,27.66 | 37.47,27.66 37.47,19.96 39.06,18.36 45.03,18.36 v52.07,25.4 52.55,24.92 75.03,25.07 77.62,22.48 v77.62,22.35 | v39.37,27.94 37.74,27.94 37.47,27.66
  other vias: 105.41,10.16 108.58,10.16 114.3,10.16 118.11,10.16 118.11,6.99 114.3,6.99 111.76,6.99 108.58,6.99 105.41,6.99
  pour Top: 104.78,15.24 104.14,14.61 104.14,6.35 105.41,5.08 118.75,5.08 123.19,9.53 123.19,14.61 122.56,15.24
  pour Bottom (isolate 1): 104.78,15.24 104.14,14.61 104.14,6.35 105.41,5.08 118.75,5.08 123.19,9.53 123.19,14.61 122.56,15.24
N$1
  Top 0.305: 76.03,6.18 73.03,3.17 46.35,3.17 46.24,3.29 IC1.23
  Top 0.356: 76.03,6.18 IC2.5
N$2
  Top 0.305: IC1.9 34.54,14.36 29.21,19.68
  Top 0.356: 29.21,19.68 RN1.6
  Bottom 0.305: 14.91,45.97 24.38,45.97 25.4,44.96 25.4,40.01 RN1.6
  Bottom 0.406: J5.1 11.4,49.48 14.91,45.97
N$3
  Top 0.254: 35.31,14.86 IC1.8
  Top 0.305: 35.31,14.86 31.75,18.41
  Top 0.356: 31.75,18.41 RN1.7
  Bottom 0.305: J6.1 16.48,49.45 18.97,46.97 26.16,46.97 27.84,45.29 27.84,45.19 27.96,45.06 27.96,39.98 RN1.7
N$4
  Top 0.305: IC1.44 55.73,16.36 66.67,27.3 | J27.1 90.19,41.45 91.26,40.46 94.54,40.46 95.12,39.88 96.72,39.88 96.85,39.75 98.81,37.72 | 98.73,37.8 98.81,37.72 | 98.81,37.72 RN4.4
  Top 0.356: 66.67,27.3 83.82,27.3 87.63,31.11 96.52,31.11 100.33,34.92 RN4.4
N$5
  Top 0.305: IC1.45 54.95,16.86 66.04,27.94 | J26.1 85.11,41.43 85.8,40.54 89.41,40.49 91.14,39.01 94.26,39.04 94.28,39.04 95,38.33 96.19,38.33 97.74,36.78 97.74,36.25 RN4.3
  Top 0.356: 66.04,27.94 82.55,27.94 86.36,31.75 94.61,31.75 97.79,34.92 RN4.3
N$6
  Top 0.305: IC1.46 54.19,17.36 65.41,28.57 | J25.1 80.03,41.27 81.66,39.57 88.47,39.55 90.32,37.77 93.83,37.8 RN4.2
  Top 0.356: 65.41,28.57 81.28,28.57 85.72,33.02 93.34,33.02 95.25,34.92 RN4.2
N$7
  Top 0.254: 36.08,15.36 IC1.7
  Top 0.305: 34.29,17.14 36.08,15.36
  Top 0.356: 34.29,17.14 RN1.8
  Bottom 0.305: J7.1 21.57,49.3 22.78,48.08 28.02,48.08 30.53,45.57 30.53,39.95 RN1.8
N$8
  Top 0.305: IC1.61 44.74,30.77 45.72,31.75
  Top 0.356: 45.72,31.75 51.44,31.75 54.61,34.92 RN2.6
  Bottom 0.305: J13.1 34.21,48.54 36.75,46 44.65,46 45.72,44.93 45.8,40.28 46.61,39.55 51.49,39.55 RN2.6
N$9
  Top 0.305: IC1.60 45.24,30 46.35,31.11
  Top 0.356: 46.35,31.11 52.7,31.11 57.15,35.56 RN2.7
  Bottom 0.305: J14.1 39.29,49.38 41.1,47.3 46.51,47.3 48.01,46.08 48.18,46.08 48.23,45.95 48.23,41.2 48.79,40.51 51.99,40.49 54.36,38.02 56.06,38.02 RN2.7
N$10
  Top 0.305: IC1.52 49.24,23.2 49.53,23.5 | J19.1 67.39,41 68.71,39.7 71.37,39.7 72.82,38.25 73.1,38.02 RN3.4
  Top 0.356: 49.53,23.5 52.07,23.5 60.96,32.38 72.39,32.38 74.93,34.92 RN3.4
N$11
  Top 0.305: IC1.56 47.24,26.92 48.9,28.57 | J18.1 62.31,42.42 66.14,38.66 70,38.66 RN3.3
  Top 0.356: 48.9,28.57 55.88,28.57 60.33,33.02 70.48,33.02 72.39,34.92 RN3.3
N$12
  Top 0.356: IC2.18 85.56,15.4 88.9,12.06 88.9,10.16 90.17,8.89 96.52,8.89 97.79,7.62 JP31.1
N$13
  Top 0.305: IC1.59 45.74,29.23 46.99,30.48
  Top 0.356: 46.99,30.48 53.98,30.48 RN2.8
  Bottom 0.305: J15.1 44.37,48.74 44.83,48.28 49.94,48.28 53.44,44.78 53.42,40.49 54.99,38.91 57.68,38.91 RN2.8
N$14
  Top 0.305: IC1.50 50.24,21.66 50.8,22.23
  Top 0.356: 50.8,22.23 53.34,22.23 62.23,31.11 76.2,31.11 80.01,34.92 RN3.6
  Bottom 0.305: J21.1 57.1,47.98 59,46.08 69.8,46.08 71.32,44.55 71.32,40.23 73.33,38.18 77.7,38.18 RN3.6
N$15
  Top 0.305: IC1.49 53.12,20.11
  Top 0.356: 53.12,20.11 63.5,30.48 78.11,30.48 82.55,34.92 RN3.7
  Bottom 0.305: J22.1 62.18,49.15 63.5,47.83 70.89,47.83 73.71,45.01 73.71,44.93 73.74,40.18 74.98,38.91 80.14,38.91 RN3.7
N$16
  Top 0.305: IC1.63 43.74,32.31 | J11.1 44.35,41.66 45.7,40.31 45.7,40.03 RN2.4
  Top 0.356: 43.74,32.31 44.45,33.02 47.62,33.02 49.53,34.92 RN2.4
N$17
  Top 0.305: IC1.1 41.49,31.33 | J10.1 39.27,41.48 40.51,40.23 42.95,40.23 RN2.3
  Top 0.356: RN2.3 46.99,34.92 45.72,33.66 43.81,33.66 41.49,31.33
N$18
  Top 0.305: IC1.4 38.39,16.86 37.47,17.78 | J9.1 34.19,40.64 34.67,40.16 38.71,40.16 40.44,38.43 42.22,38.43 RN2.2
  Top 0.356: 37.47,17.78 37.47,28.57 44.45,35.56 RN2.2
N$19
  Top 0.305: IC1.48 52.65,18.36 53.34,19.05
  Top 0.356: 53.12,18.84 53.34,19.05 64.14,29.84 80.01,29.84 85.09,34.92 RN3.8
  Bottom 0.305: J23.1 67.26,49.68 68.15,48.79 74.37,48.79 76.63,46.53 76.63,44.6 76.58,44.55 76.58,42.47 76.63,42.29 76.63,40.08 77.06,39.65 81.76,39.62 RN3.8
N$20
  Top 0.305: IC1.42 57.27,15.36 67.94,26.04
  Top 0.356: 67.94,26.04 86.36,26.04 89.53,29.21 99.69,29.21 105.41,34.92 RN4.6
  Bottom 0.305: RN4.6 99.49,42.11 99.52,42.14 99.52,44.35 97.87,46 84,46 83.84,46.15 83.8,46.15 82.32,47.62 81.64,47.62 79.96,49.3 79.96,50.75 J29.1
N$21
  Top 0.305: IC1.40 58.17,14.36 69.22,25.4
  Top 0.356: 69.22,25.4 87.63,25.4 90.17,27.94 100.97,27.94 107.95,34.92 RN4.7
  Bottom 0.305: J30.1 85.09,47.75 85.98,46.86 86.08,46.86 86.31,46.63 98.12,46.63 100.25,44.5 100.25,42.32 100.36,42.22 100.36,42.14 104.67,37.82 106.32,37.82 RN4.7
N$22
  Top 0.305: IC1.11 33,13.36 24.13,22.23
  Top 0.356: 24.13,22.23 RN1.4
  Top 0.406: J3.1 21.59,38.73 RN1.4
N$23
  Top 0.305: IC1.12 32.23,12.86 21.59,23.5
  Top 0.356: 21.59,23.5 RN1.3
  Top 0.406: J2.1 16.51,41.27 RN1.3
N$24
  Top 0.305: IC1.13 31.46,12.36 19.05,24.77
  Top 0.356: 19.05,24.77 RN1.2
  Top 0.406: J1.1 11.53,43.08 11.53,40.08 12.88,38.73 16.51,38.73 RN1.2
N$25
  Top 0.356: IC2.17 85.09,14.61 87.63,12.06 87.63,10.16 90.17,7.62 JP31.4
N$26
  Top 0.356: IC2.16 84.62,13.8 86.36,12.06 86.36,8.89 87.63,7.62 JP31.5
N$31  (via drill 0.6)
  Top 0.305: v124.66,16.26 123.95,16.97 IC6.1
  Top 0.356: IC2.10 80.03,7.59 85.09,2.54 v119.38,2.54
  Bottom 0.305: v119.38,2.54 120.12,3.28 120.12,4.32 124.66,8.87 v124.66,16.26
N$32
  Top 0.305: 125.09,9.53 127.76,12.19 IC6.4
  Top 0.356: IC2.11 80.83,8.06 85.09,3.81 119.38,3.81 125.09,9.53
N$33
  Top 0.305: C11.1 115.59,39.01 116.38,38.12 116.38,31.85 117.17,31.47 117.2,30.94 117.22,28.19 117.81,27.66 118.78,27.66 R6.2 118.85,27.65 R7.1
N$34  (via drill 0.6)
  Top 0.305: IC7.1 123.33,27.42 v123.32,27.41 | L3.1 118.21,32.16 118.21,33.3 118.97,34.06 121.77,34.06 122.33,33.5 v122.38,33.5
  Top 0.406: IC6.7 125.2,24.72 125.2,26.36 124.78,26.78 IC7.1 | L3.1 118.22,30.58 R6.1
  Bottom 0.305: v123.32,27.41 123.32,27.69 123.34,27.71 123.77,27.71 124.61,28.55 124.56,30.56 122.53,31.7 122.43,31.7 v122.38,33.5
N$35
  Top 0.356: 90.36,18.22 87.63,20.95 87.61,22.71 86.79,23.39 76,23.39 75.26,22.73 IC2.30
  Top 0.406: 90.36,18.22 IC5.P$3 92.08,18.22 92.08,18.41
N$36  (via drill 0.6)
  Top 0.305: C1.2 120.65,21.86 120.65,20.32 | 111.12,19.68 110.53,20.28 C32.2 | v112.19,24.43 112.45,23.67 113.68,22.24
  Top 0.406: 111.12,19.68 113.68,22.24 115.37,23.93 119.51,23.93 120.18,23.25 C1.2
  Top 0.61: 111.12,19.68 111.05,19.61 IC3.1 | IC4.1 120.57,19.61 120.65,19.68 120.65,20.32 | C12.+ 116.64,45.72 D1.C 112.78,42.67 D2.C 111.71,42.6 v111.43,42.7
  Bottom 0.305: v111.43,42.7 111.58,42.16 114.3,39.45 114.3,32.33 112.42,30.45 112.34,30.35 v112.19,24.43
N$37  (via drill 0.6 pad 1.42)
  Top 0.305: IC1.15 39.93,11.36 39.37,10.79 | v39.37,9.53 41.91,9.53 | IC1.17 42.33,9.11 41.91,9.53 | IC1.16 41.49,9.95 41.91,9.53
  Top 0.356: IC2.31 74.44,21.88 73.66,22.66 72.59,22.68 v71.27,22.73 | v39.37,9.53 39.37,10.79
  Bottom 0.305: 70.66,23.24 54.3,23.24 53.67,22.61
  Bottom 0.356: 53.67,22.61 47.62,17.14 47.62,15.24 41.91,9.53 v39.37,9.53
  Bottom 0.61: v71.27,22.73 71.17,22.73 70.66,23.24
N$38
  Top 0.305: IC1.57 46.74,27.69 48.26,29.21 | J17.1 57.23,40.82 57.38,40.66 62.41,40.66 64.16,38.91 64.11,38.91 65.23,37.8 68.71,37.8 RN3.2
  Top 0.356: 48.26,29.21 55.24,29.21 59.69,33.66 68.58,33.66 69.85,34.92 RN3.2
N$39  (via drill 0.6)
  Top 0.305: IC1.38 59.71,13.36 70.48,24.13 | LED8.C 77.8,52.3 79.2,53.7 93.93,53.7 95.35,52.27 95.35,50.9 J32.1 | v109.07,31.32 106.88,31.32 101.6,26.04
  Top 0.356: 70.48,24.13 90.17,24.13 92.08,26.04 101.6,26.04
  Bottom 0.305: J32.1 95.25,49.2 95.22,49.17 95.22,48.97 95.61,48.56 95.61,48.54 96.14,48.01 98.6,48.01 102.08,44.53 102.08,42.49 104.5,40.08 109.22,40.08 111.71,37.59 111.71,33.96 v109.07,31.32
N$40
  Top 0.305: IC1.36 65.06,12.36 68.11,15.4
  Top 0.356: 68.11,15.4 IC2.38
N$41
  Top 0.305: IC1.35 65.83,11.86 68.58,14.61
  Top 0.356: 68.58,14.61 IC2.39
N$42
  Top 0.305: IC1.34 66.6,11.36 69.05,13.8
  Top 0.356: 69.05,13.8 IC2.40
N$43
  Top 0.305: IC1.33 67.37,10.86 69.52,13.01
  Top 0.356: 69.52,13.01 IC2.41
N$44
  Top 0.305: IC1.32 52.28,9.11 53.34,10.16 67.94,10.16 68.39,10.61 IC2.44
  Top 0.356: 67.94,10.16 68.16,10.38
N$45
  Top 0.305: IC1.31 50.24,8.18 50.8,7.62 52.07,7.62 53.98,9.53 71.75,9.53 72.47,8.8 IC2.1
N$46
  Top 0.305: 73.64,7.59 71.12,5.08 48.26,5.08 48.24,5.1 IC1.27
  Top 0.356: 73.64,7.59 IC2.2
N$47
  Top 0.305: IC1.19 44.24,6.78 43.81,6.35
  Top 0.356: 43.81,6.35 34.29,6.35 24.13,16.51 14.61,16.51 12.7,18.41 OK2.2
N$48
  Top 0.305: IC1.18 43.74,7.54 43.18,6.99
  Top 0.356: 43.18,6.99 34.92,6.99 24.13,17.78 14.61,17.78 12.06,20.32 6.99,20.32 6.35,19.68 OK1.2
N$49
  Top 0.61: OK1.1 3.81,14.35 R2.1
N$50
  Top 0.356: 8.89,17.14 OK2.1
  Top 0.61: 8.89,17.14 8.89,14.41 R1.1
N$51
  Top 0.305: JP10.4 OK1.4
N$52
  Top 0.305: OK1.3 JP10.3
N$53
  Top 0.305: JP10.2 OK2.4
N$54
  Top 0.305: OK2.3 JP10.1
N$55  (via drill 0.6)
  Top 0.305: LED1.A 9.02,40.18 v9.32,39.88
  Bottom 0.305: v9.32,39.88 9.88,39.32 23.55,39.32 RN1.5
N$56
  Top 0.305: IC1.39 58.94,13.86 69.85,24.77
  Top 0.356: 69.85,24.77 88.9,24.77 91.44,27.3 101.6,27.3 107.95,33.66 109.22,33.66 110.49,34.92 RN4.8
  Bottom 0.305: J31.1 90.09,50.72 90.09,49.3 92.1,47.3 98.32,47.3 101.02,44.6 101.02,42.44 104.24,39.22 107.47,39.22 RN4.8
N$57  (via drill 0.6)
  Top 0.305: LED3.A 31.9,41.17 v32.41,40.66
  Bottom 0.305: v32.41,40.66 32.41,40.16 34.42,38.56 45.92,38.53 46,38.53 50.24,38.51 RN2.5
N$58
  Top 0.305: RN1.9 36.83,37.16 35.76,38.23 29.74,38.23 27.99,39.98 27.99,45.16 26.11,47.04 12.23,47.04 LED2.A
N$59  (via drill 0.6)
  Top 0.305: LED5.A v54.94,40.59
  Bottom 0.305: v54.94,40.59 54.94,40.51 55.65,39.8 69.93,39.8 72.24,37.47 76.2,37.47 RN3.5
N$60
  Top 0.305: LED4.A 32.03,48.82 32.54,48.31 46.97,48.26 47.32,48.23 48.84,46.89 50.77,44.88 50.72,41.27 54.15,38.1 60.4,38.02 RN2.9
N$61  (via drill 0.6)
  Top 0.305: LED7.A 77.69,40.78 v77.75,40.72
  Bottom 0.305: v77.75,40.72 90.3,40.72 92.96,38.05 101.02,38.05 RN4.5
N$62
  Top 0.305: LED6.A 54.86,49.07 56.26,47.42 71.3,47.42 73.66,45.06 73.66,40.46 75.64,38.35 79.43,38.35 80.01,37.77 86.67,37.77 87.45,36.98 87.45,36.37 RN3.9
N$63
  Top 0.305: IC1.10 33.77,13.86 26.67,20.95 26.67,33.71 28.04,35.08 28.04,37.31 26.67,38.68 J4.1 26.8,43.31 26.8,44.68 26.11,45.36 9.78,45.36 9.02,44.6 LED1.C
N$64
  Top 0.305: LED8.A 77.8,48.72 78.87,47.65 97.66,47.65 99.95,45.36 99.95,42.82 104.14,38.63 110.59,38.63 110.73,38.49 RN4.9
N$65
  Top 0.305: IC1.58 46.24,28.46 47.62,29.84 | LED4.C 32.03,52.86 33.12,53.95 48.23,53.95 49.51,52.68 49.51,51.16 J16.1 49.76,49.05 51.59,47.22 51.71,47.04 53.39,45.49 53.34,40.23 54.41,39.29 62.26,39.24 63.96,37.47
  Top 0.356: 47.62,29.84 54.61,29.84 59.05,34.29 62.74,34.31 63.96,35.56 63.96,37.47
N$66
  Top 0.305: IC1.51 49.74,22.43 50.16,22.86 | 78.69,35.26 78.77,35.59 78.77,37.21 78.28,37.54 75.03,37.54 74.5,38.05 74.5,38.08 72.47,40.11 J20.1 72.44,43.08 72.44,44.58 71.07,45.95 56.84,45.95 56.29,45.39 56.21,45.39 54.94,44.12 LED5.C
  Top 0.356: 78.69,35.26 74.93,31.75 61.59,31.75 52.7,22.86 50.16,22.86
N$67
  Top 0.305: IC1.6 38.12,15.86 36.83,17.14 | LED2.C 9.17,52.83 9.93,53.59 25.48,53.59 26.64,52.43 J8.1 26.64,49.63 30.63,45.64 30.63,40.11 31.62,39.19 37.72,39.19 39.37,37.47
  Top 0.356: 36.83,17.14 36.83,29.84 39.37,32.38 39.37,37.47
N$68
  Top 0.305: IC1.62 44.24,31.54 45.09,32.38 | LED3.C 31.9,44.76 33.2,46.69 47.42,46.69 49.45,44.63 49.45,43.2 J12.1 49.43,40.11 51.82,37.62 52.7,37.62 53.39,36.91 53.37,34.95 53.34,34.92
  Top 0.356: 45.09,32.38 50.8,32.38 53.34,34.92
N$69
  Top 0.305: IC1.47 53.41,17.86 64.77,29.21 | LED6.C 54.86,52.55 56.29,53.98 71.09,53.98 72.31,52.76 72.31,51.1 J24.1 72.77,50.65 72.77,49.71 73.74,48.74 75.08,48.74 76.53,47.3 76.53,40.11 77.52,39.24 79.88,39.24 80.54,38.58 87.53,38.58 89.59,36.52 89.59,34.87
  Top 0.356: 64.77,29.21 80.64,29.21 85.09,33.66 88.9,33.66 89.59,34.87
N$70
  Top 0.305: IC1.43 56.49,15.86 67.31,26.67 | LED7.C 77.69,45.68 78.72,46.51 93.67,46.51 95.43,44.68 95.43,43.23 J28.1 95.28,41.71 95.38,41.6 95.4,41.6 96.14,40.79 99.44,40.79 101.58,38.73 101.58,32.36 101.24,32.03
  Top 0.356: 67.31,26.67 85.09,26.67 88.27,29.84 99.06,29.84 101.24,32.03
N$71
  Top 0.305: 74.44,7.12 71.75,4.45 47.62,4.45 47.24,4.83 IC1.25
  Top 0.356: 74.44,7.12 IC2.3
N$72
  Top 0.305: 75.23,6.66 72.39,3.81 46.99,3.81 46.74,4.06 IC1.24
  Top 0.356: 75.23,6.66 IC2.4
N$73
  Top 0.406: IC6.8 123.45,24.94 116.64,24.94 116.2,25.63 R3.2
N$74
  Top 0.356: IC2.19 86.03,16.2 90.17,12.06 90.17,10.16 90.81,9.53 95.89,9.53 JP12.2 100.33,11.43 R5.1
N$75
  Top 0.356: IC2.20 86.5,17 JP11.2 94.61,11.43 R4.1
N$76
  Top 0.305: 69.85,7.62 71.12,8.89 | 69.85,7.62 69.85,8.26 | 69.85,7.62 70.48,7.62
N$77
  Top 0.305: 99.06,8.26 100.33,9.53 | 99.06,8.26 99.06,8.89 | 99.06,8.26 99.69,8.26
N$78
  Top 0.356: IC2.15 84.15,13.01 85.09,12.06 JP31.6
N$79
  Top 0.305: IC1.20 44.74,2.25 45.09,1.91 80.64,1.91 81.28,2.54 81.28,5.08 79.23,7.12
  Top 0.356: 79.23,7.12 IC2.9
N$80
  Top 0.305: IC1.22 45.74,2.56 45.72,2.54 80.01,2.54 80.64,3.17 80.64,4.45 78.44,6.66
  Top 0.356: 78.44,6.66 IC2.8
N$82
  Top 0.305: 126.92,30.76 122.16,30.76 R7.2
  Top 0.406: IC6.6 126.44,24.75 126.44,26.19 | 126.44,26.19 126.68,26.43 IC7.2 | L3.2 119.82,31.62 R7.2 | 126.44,26.19 126.47,26.19 126.67,26.39 126.67,27.64 127.2,28.02 127.18,30.56 126.92,30.76
N$83
  Top 0.305: 126.36,52.78 PWR1.1 126.39,52.15 128.22,52.15 128.8,51.61 128.78,47.62 127.94,46.91 126.42,46.91 PWR2.1 | 127.23,54.86 F1.2
  Top 0.61: 127.23,53.65 127.23,52.98 126.39,52.15 126.39,52.22 127.53,53.37 127.53,54.91 F1.2
N$84
  Top 0.61: F1.1 122.73,55.09 115.62,55.09 R8.1 114.12,54.03 112.83,52.73 112.83,49.17 D1.A
N$88
  Top 0.305: CAN1.1 127.99,40.08 128.47,39.5 128.65,35.61 127.69,34.92 126.72,34.92 | 126.72,34.92 126.21,34.92 CAN2.1 | C16.2 117.55,39.79 117.55,37.87 118.22,37.2 L3.4 118.22,35.19 118.44,34.98 126.67,34.98 126.72,34.92
N$89
  Top 0.305: C15.2 119.69,36.98 L3.3 124.02,36.84 124.54,37.36 126.09,37.36 CAN1.2
  Bottom 0.305: CAN1.2 128.22,37.54 128.65,36.96 128.6,33.3 127.86,32.31 126.19,32.31 CAN2.2
N$95  (via drill 0.6)
  other vias: 15.21,20.47
TCK
  Top 0.305: IC1.30 49.74,7.41 50.16,6.99 52.7,6.99 54.61,8.89 62.23,8.89 63.5,7.62 JP30.3
TDI
  Top 0.305: IC1.28 48.74,5.87 48.9,5.71 57.15,5.71 JP30.5
TDO  (via drill 0.6 pad 1.42)
  Top 0.305: IC1.53 48.74,18.26 48.74,17.93 49.53,17.14 v50.16,17.14
  Bottom 0.356: JP30.4 60.96,8.89 52.7,17.14 v50.16,17.14
TMS
  Top 0.305: JP30.6 55.24,6.35 49.53,6.35 49.24,6.64 IC1.29
V33  (via drill 0.6 pad 1.42)
  Top 0.305: v48.9,26.04 47.74,24.88 IC1.55 47.74,17.89 46.35,16.51 43.81,16.51 42.97,17.36 IC1.3 39.8,17.36 39.37,17.78 v39.37,20.95 | 62.23,13.97 61.12,12.86 IC1.37 49.69,12.86 47.74,10.91 IC1.26
  Top 0.356: 62.23,13.97 C5.1 62.5,14.24 v64.77,16.51 | C4.1 50.16,27.3 v48.9,26.04
  Top 0.406: R2.2 8.89,12.38 R1.2 10.7,12.45 12.52,14.28 14.4,14.28 C6.+
  Top 0.61: v39.37,20.95 C7.1 | v113.03,17.14 115.57,19.68 115.65,19.61 IC4.3
  Bottom 0.61: v39.37,20.95 40.64,20.95 45.72,26.04 v48.9,26.04 50.16,27.3 53.82,27.3 55.52,27.33 78.99,27.41 82.19,23.6 82.37,23.65 82.47,23.65 81.94,23.52 | C6.+ 20.95,8.26 25.4,3.81 66.67,3.81 68.58,5.71 JP30.1 68.58,16.51 v64.77,16.51 64.77,19.25 67.26,21.74 70,21.74 70.36,21.44 70.99,20.8 74.98,20.83 80.06,20.85 82.45,23.42 81.94,23.52 | v113.03,17.14 113,17.12 107.54,17.12 105.08,19.58 105,19.58 100.58,24 88.42,24 87.91,23.5 81.94,23.52
V50  (via drill 0.6, 0.6 pad 1.42)
  Top 0.305: IC6.3 126.57,19.57 v126.57,21.49
  Top 0.356: 76.83,17.78 IC2.28 | 76.83,17.78 73.66,17.78 72.83,18.61 | 72.83,18.61 IC2.34 69.41,18.61 69.22,18.41 C10.1 | 72.83,18.61 IC2.33 | 85.72,19.05 C2.1 | 85.72,19.05 84.45,19.05 83.82,19.68 81.92,19.68 80.01,17.78 77.47,17.78 | 86.36,19.05 85.72,19.05 | C3.1 79.38,4.45 77.64,6.18 IC2.7 77.64,17.61 77.47,17.78 | 77.47,17.78 76.83,17.78
  Top 0.61: 100.33,18.41 R5.2 101.28,13.02 102.23,12.06 102.23,7.62 99.69,5.08 95.89,5.08 95.25,5.71 JP31.2 | 94.61,15.88 R4.2 | 94.61,15.88 94.61,16.51 96.33,18.22 97.16,18.22 | 86.36,19.05 89.53,15.88 94.61,15.88 | 100.33,18.41 C8.1 101.23,19.32 v104.78,22.86 106.05,21.59 106.05,19.68 106.12,19.61 IC3.3 | 100.33,18.41 97.16,18.41 97.16,18.22 | 97.16,18.22 IC5.P$4
  Bottom 0.305: v126.57,21.49 124.13,23.93 115.04,23.93 113.97,22.86 104.24,22.86
  Bottom 0.61: 92.71,34.29 104.14,22.86 104.24,22.86 v104.78,22.86 | 16.51,34.29 41.91,34.29 | 41.91,34.29 67.31,34.29 | 67.31,34.29 92.71,34.29 | C9.+ 16.51,34.29 | 92.71,34.29 RN4.1 | 67.31,34.29 RN3.1 | 41.91,34.29 RN2.1 | 16.51,34.29 RN1.1

### Text on the board
tNames: BMS Master V2.0 | www.smart-electro.net